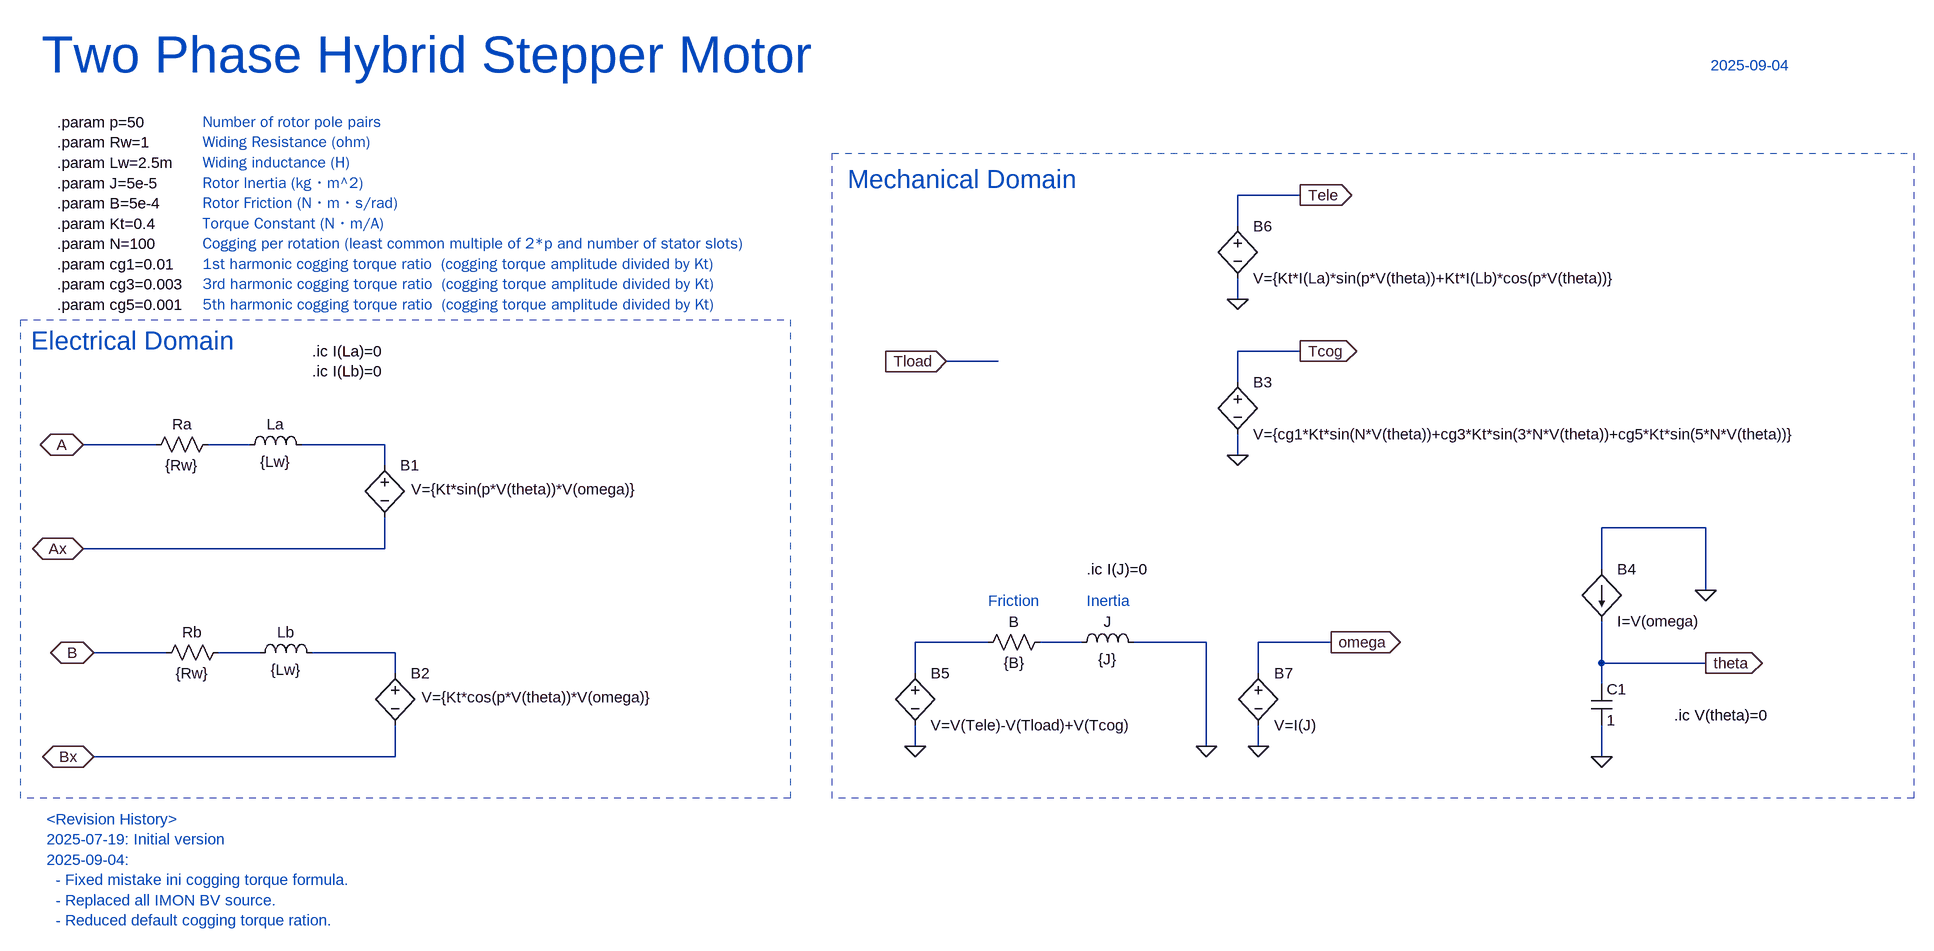
[diagram p0: schematic STEPPER_2PH.asc]
STEPPER_2PH.asc, the LTspice schematic file:
Version 4.1
SHEET 1 2756 2296
WIRE 1808 256 1712 256
WIRE 1712 304 1712 256
WIRE 1712 416 1712 384
WIRE 1808 496 1712 496
WIRE 1344 512 1264 512
WIRE 1712 544 1712 496
WIRE 48 640 -64 640
WIRE 192 640 128 640
WIRE 400 640 272 640
WIRE 1712 656 1712 624
WIRE 400 672 400 640
WIRE 2432 768 2272 768
WIRE 400 800 400 752
WIRE 400 800 -64 800
WIRE 2272 832 2272 768
WIRE 2432 864 2432 768
WIRE 1328 944 1216 944
WIRE 1472 944 1408 944
WIRE 1664 944 1552 944
WIRE 1856 944 1744 944
WIRE 64 960 -48 960
WIRE 208 960 144 960
WIRE 416 960 288 960
WIRE 2272 976 2272 912
WIRE 2432 976 2272 976
WIRE 416 992 416 960
WIRE 1216 992 1216 944
WIRE 1744 992 1744 944
WIRE 2272 1008 2272 976
WIRE 1216 1104 1216 1072
WIRE 1664 1104 1664 944
WIRE 1744 1104 1744 1072
WIRE 416 1120 416 1072
WIRE 416 1120 -48 1120
WIRE 2272 1120 2272 1072
FLAG 1712 656 0
FLAG 1216 1104 0
FLAG 2272 1120 0
FLAG 1264 512 Tload
IOPIN 1264 512 In
FLAG -64 640 A
IOPIN -64 640 BiDir
FLAG -64 800 Ax
IOPIN -64 800 BiDir
FLAG -48 960 B
IOPIN -48 960 BiDir
FLAG -48 1120 Bx
IOPIN -48 1120 BiDir
FLAG 2432 976 theta
IOPIN 2432 976 Out
FLAG 1808 496 Tcog
IOPIN 1808 496 Out
FLAG 1664 1104 0
FLAG 2432 864 0
FLAG 1712 416 0
FLAG 1808 256 Tele
IOPIN 1808 256 Out
FLAG 1744 1104 0
FLAG 1856 944 omega
IOPIN 1856 944 Out
SYMBOL res 144 624 R90
WINDOW 0 0 56 VBottom 2
WINDOW 3 32 56 VTop 2
SYMATTR InstName Ra
SYMATTR Value {Rw}
SYMBOL ind 176 656 R270
WINDOW 0 32 56 VTop 2
WINDOW 3 5 56 VBottom 2
SYMATTR InstName La
SYMATTR Value {Lw}
SYMBOL res 160 944 R90
WINDOW 0 0 56 VBottom 2
WINDOW 3 32 56 VTop 2
SYMATTR InstName Rb
SYMATTR Value {Rw}
SYMBOL ind 192 976 R270
WINDOW 0 32 56 VTop 2
WINDOW 3 5 56 VBottom 2
SYMATTR InstName Lb
SYMATTR Value {Lw}
SYMBOL bv 416 976 R0
WINDOW 3 41 53 Left 2
SYMATTR Value V={Kt*cos(p*V(theta))*V(omega)}
SYMATTR InstName B2
SYMBOL bv 1712 528 R0
SYMATTR InstName B3
SYMATTR Value V={cg1*Kt*sin(N*V(theta))+cg3*Kt*sin(3*N*V(theta))+cg5*Kt*sin(5*N*V(theta))}
SYMBOL ind 1456 960 R270
WINDOW 0 32 56 VTop 2
WINDOW 3 5 56 VBottom 2
SYMATTR InstName J
SYMATTR Value {J}
SYMBOL bv 1216 976 R0
SYMATTR InstName B5
SYMATTR Value V=V(Tele)-V(Tload)+V(Tcog)
SYMBOL cap 2256 1008 R0
SYMATTR InstName C1
SYMATTR Value 1
SYMBOL res 1424 928 R90
WINDOW 0 0 56 VBottom 2
WINDOW 3 32 56 VTop 2
SYMATTR InstName B
SYMATTR Value {B}
SYMBOL bi 2272 832 R0
SYMATTR InstName B4
SYMATTR Value I=V(omega)
SYMBOL bv 400 656 R0
WINDOW 3 41 53 Left 2
SYMATTR Value V={Kt*sin(p*V(theta))*V(omega)}
SYMATTR InstName B1
SYMBOL bv 1712 288 R0
SYMATTR InstName B6
SYMATTR Value V={Kt*I(La)*sin(p*V(theta))+Kt*I(Lb)*cos(p*V(theta))}
SYMBOL bv 1744 976 R0
SYMATTR InstName B7
SYMATTR Value V=I(J)
TEXT -104 144 Left 2 !.param p=50\n.param Rw=1\n.param Lw=2.5m\n.param J=5e-5\n.param B=5e-4\n.param Kt=0.4\n.param N=100\n.param cg1=0.01\n.param cg3=0.003\n.param cg5=0.001
TEXT -128 40 Left 6 ;Two Phase Hybrid Stepper Motor
TEXT 2440 56 Left 2 ;2025-09-04
TEXT 2384 1056 Left 2 !.ic V(theta)=0
TEXT 1480 832 Left 2 !.ic I(J)=0
TEXT 1480 880 Left 2 ;Inertia
TEXT 1328 880 Left 2 ;Friction
TEXT 288 496 Left 2 !.ic I(La)=0\n.ic I(Lb)=0
TEXT 120 144 Left 2 ;Number of rotor pole pairs\nWiding Resistance (ohm)\nWiding inductance (H)\nRotor Inertia (kg・m^2)\nRotor Friction (N・m・s/rad)\nTorque Constant (N・m/A)\nCogging per rotation (least common multiple of 2*p and number of stator slots)\n1st harmonic cogging torque ratio  (cogging torque amplitude divided by Kt)\n3rd harmonic cogging torque ratio  (cogging torque amplitude divided by Kt)\n5th harmonic cogging torque ratio  (cogging torque amplitude divided by Kt)
TEXT -120 1216 Left 2 ;<Revision History>\n2025-07-19: Initial version\n2025-09-04: \n  - Fixed mistake ini cogging torque formula.\n  - Replaced all IMON BV source.\n  - Reduced default cogging torque ration.
TEXT -144 480 Left 4 ;Electrical Domain
TEXT 1112 232 Left 4 ;Mechanical Domain
RECTANGLE Normal 1024 1184 -160 448 2
RECTANGLE Normal 2752 1184 1088 192 2

The netlist it stands for:
* STEPPER_2PH.asc
Ra N001 A {Rw}
La N001 N002 {Lw}
Rb N005 B {Rw}
Lb N005 N006 {Lw}
B2 N006 Bx V={Kt*cos(p*V(theta))*V(omega)}
B3 Tcog 0 V={cg1*Kt*sin(N*V(theta))+cg3*Kt*sin(3*N*V(theta))+cg5*Kt*sin(5*N*V(theta))}
L§J N004 0 {J}
B5 N003 0 V=V(Tele)-V(Tload)+V(Tcog)
C1 theta 0 1
R§B N004 N003 {B}
B4 0 theta I=V(omega)
B1 N002 Ax V={Kt*sin(p*V(theta))*V(omega)}
B6 Tele 0 V={Kt*I(La)*sin(p*V(theta))+Kt*I(Lb)*cos(p*V(theta))}
B7 omega 0 V=I(J)
.param p=50
.param Rw=1
.param Lw=2.5m
.param J=5e-5
.param B=5e-4
.param Kt=0.4
.param N=100
.param cg1=0.01
.param cg3=0.003
.param cg5=0.001
* Two Phase Hybrid Stepper Motor
* 2025-09-04
.ic V(theta)=0
.ic I(J)=0
* Inertia
* Friction
.ic I(La)=0
.ic I(Lb)=0
* Number of rotor pole pairs
* Widing Resistance (ohm)
* Widing inductance (H)
* Rotor Inertia (kg・m^2)
* Rotor Friction (N・m・s/rad)
* Torque Constant (N・m/A)
* Cogging per rotation (least common multiple of 2*p and number of stator slots)
* 1st harmonic cogging torque ratio  (cogging torque amplitude divided by Kt)
* 3rd harmonic cogging torque ratio  (cogging torque amplitude divided by Kt)
* 5th harmonic cogging torque ratio  (cogging torque amplitude divided by Kt)
* <Revision History>
* 2025-07-19: Initial version
* 2025-09-04:
*   - Fixed mistake ini cogging torque formula.
*   - Replaced all IMON BV source.
*   - Reduced default cogging torque ration.
* Electrical Domain
* Mechanical Domain
.backanno
.end